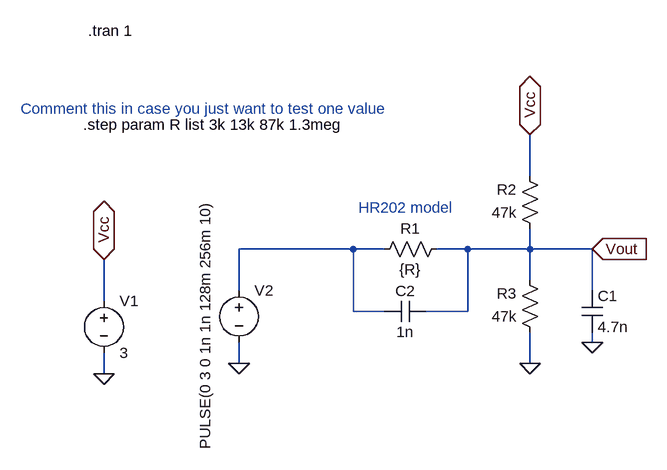
[diagram p0: schematic hr202.asc]
hr202.asc, the LTspice schematic file:
Version 4
SHEET 1 888 680
WIRE 272 16 272 -48
WIRE 0 128 -176 128
WIRE 48 128 0 128
WIRE 176 128 128 128
WIRE 272 128 272 96
WIRE 272 128 176 128
WIRE 368 128 272 128
WIRE 272 176 272 128
WIRE -176 192 -176 128
WIRE 368 192 368 128
WIRE -384 208 -384 144
WIRE 0 224 0 128
WIRE 48 224 0 224
WIRE 176 224 176 128
WIRE 176 224 112 224
WIRE 368 272 368 256
WIRE -176 304 -176 272
WIRE 272 304 272 256
WIRE -384 320 -384 288
FLAG 272 304 0
FLAG -384 320 0
FLAG 368 272 0
FLAG -176 304 0
FLAG 368 128 Vout
IOPIN 368 128 In
FLAG -384 144 Vcc
IOPIN -384 144 BiDir
FLAG 272 -48 Vcc
IOPIN 272 -48 BiDir
SYMBOL res 144 112 R90
WINDOW 0 0 56 VBottom 2
WINDOW 3 32 56 VTop 2
SYMATTR InstName R1
SYMATTR Value {R}
SYMBOL res 288 112 R180
WINDOW 0 36 76 Left 2
WINDOW 3 36 40 Left 2
SYMATTR InstName R2
SYMATTR Value 47k
SYMBOL res 288 272 R180
WINDOW 0 36 76 Left 2
WINDOW 3 36 40 Left 2
SYMATTR InstName R3
SYMATTR Value 47k
SYMBOL cap 112 208 R90
WINDOW 0 0 32 VBottom 2
WINDOW 3 32 32 VTop 2
SYMATTR InstName C2
SYMATTR Value 1n
SYMBOL voltage -384 192 R0
WINDOW 123 0 0 Left 2
WINDOW 39 0 0 Left 2
SYMATTR InstName V1
SYMATTR Value 3
SYMBOL voltage -176 176 R0
WINDOW 123 0 0 Left 2
WINDOW 39 0 0 Left 2
WINDOW 3 -52 -124 VRight 2
SYMATTR InstName V2
SYMATTR Value PULSE(0 3 0 1n 1n 128m 256m 10)
SYMBOL cap 352 192 R0
SYMATTR InstName C1
SYMATTR Value 4.7n
TEXT -408 -208 Left 2 !.tran 1
TEXT -416 -64 Left 2 !.step param R list 3k 13k 87k 1.3meg
TEXT -512 -88 Left 2 ;Comment this in case you just want to test one value
TEXT 8 64 Left 2 ;HR202 model

The netlist it stands for:
* hr202.asc
R1 Vout N001 {R}
R2 Vout Vcc 47k
R3 0 Vout 47k
C2 Vout N001 1n
V1 Vcc 0 3
V2 N001 0 PULSE(0 3 0 1n 1n 128m 256m 10)
C1 Vout 0 4.7n
.tran 1
.step param R list 3k 13k 87k 1.3meg
* Comment this in case you just want to test one value
* HR202 model
.backanno
.end